# EAGLE design ble121lr_breakout_board_v10 (EAGLE 7.7.0)
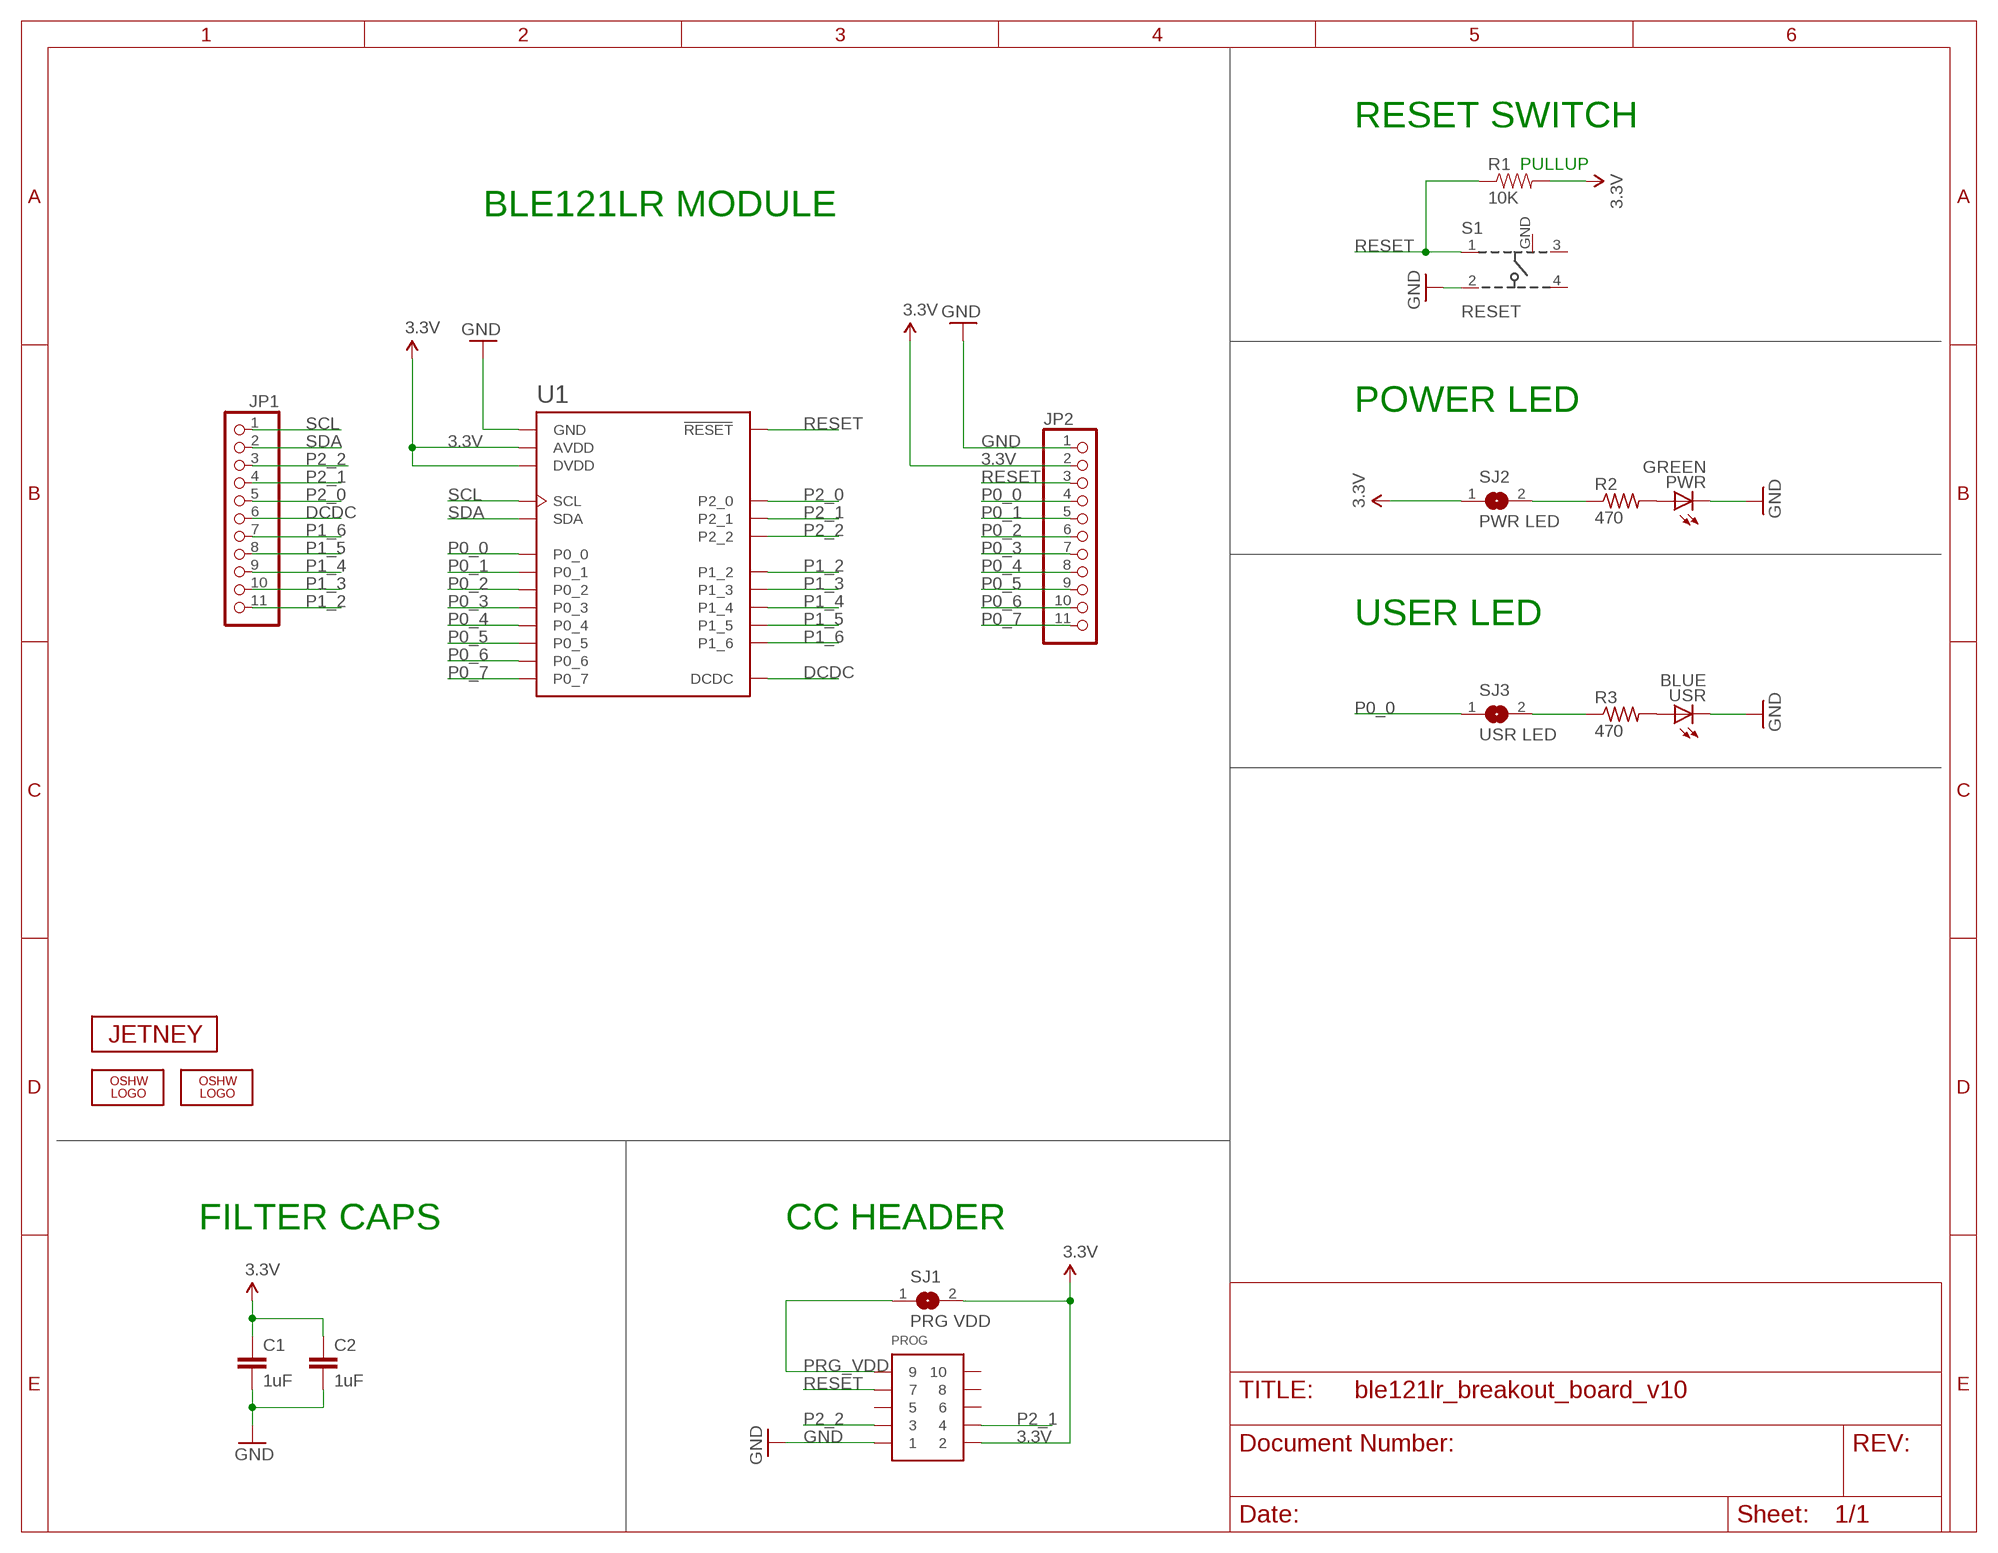
[diagram p0: schematic, sheet 1]

## Parts
C1  1uF  CAP0603-CAP  [0603-CAP]
C2  1uF  CAP0603-CAP  [0603-CAP]
JP1  PINHD-1X11  [1X11]
JP2  PINHD-1X11  [1X11]
LOGO1  OSHW_LOGO_FILLX0100-NT  [OSHW_FILLX100_NOTEXT]
LOGO2  OSHW_LOGO_FILLX0070-NT  [OSHW_FILLX70_NOTEXT]
PROG  CONN_5-2-FTSH-V  [FTSH-105-DV]
PWR  GREEN  LEDCHIPLED_0805  [CHIPLED_0805]
R1  10K  RESISTOR0603-RES  [0603-RES]
R2  470  R-US_R0603  [R0603]
R3  470  R-US_R0603  [R0603]
S1  RESET  101-IG  [101-IG]
SJ1  PRG VDD  SJ  [SJ]
SJ2  PWR LED  SJ  [SJ]
SJ3  USR LED  SJ  [SJ]
U1  BLE121LR-A  [BLE121LR-A]
U$2  JETNEY-LOGO-12  [JETNEY-LOGO-12]
USR  BLUE  LEDCHIPLED_0805  [CHIPLED_0805]

## Nets
3.3V [power]: C1.1 C2.1 JP2.2 PROG.2 R1.2 SJ1.2 SJ2.1 U1.AVDD U1.DVDD
DCDC: JP1.6 U1.DCDC
GND [power]: C1.2 C2.2 JP2.1 PROG.1 PWR.C S1.2 U1.GND U1.GND@2(GND) U1.GND@3(GND) U1.GND@4(GND) U1.GND@5(GND) U1.GND@6(GND) U1.GND@7(GND) U1.GND@8(GND) U1.GND@9(GND) U1.GND@10(GND) U1.GND@11(GND) U1.GND@12(GND) U1.GND@13(GND) USR.C
N$1: PWR.A R2.2
N$3 [power]: R2.1 SJ2.2
N$4: R3.2 USR.A
N$5: R3.1 SJ3.2
P0_0: JP2.4 SJ3.1 U1.P0_0
P0_1: JP2.5 U1.P0_1
P0_2: JP2.6 U1.P0_2
P0_3: JP2.7 U1.P0_3
P0_4: JP2.8 U1.P0_4
P0_5: JP2.9 U1.P0_5
P0_6: JP2.10 U1.P0_6
P0_7: JP2.11 U1.P0_7
P1_2: JP1.11 U1.P1_2
P1_3: JP1.10 U1.P1_3
P1_4: JP1.9 U1.P1_4
P1_5: JP1.8 U1.P1_5
P1_6: JP1.7 U1.P1_6
P2_0: JP1.5 U1.P2_0
P2_1: JP1.4 PROG.4 U1.P2_1
P2_2: JP1.3 PROG.3 U1.P2_2
PRG_VDD [power]: PROG.9 SJ1.1
RESET: JP2.3 PROG.7 R1.1 S1.1 U1.RESET
SCL: JP1.1 U1.SCL
SDA: JP1.2 U1.SDA
Unconnected: PROG.5 PROG.6 PROG.8 PROG.10 S1.3 S1.4

## Notes on the sheet
- RESET SWITCH
- PULLUP
- BLE121LR MODULE
- POWER LED
- USER LED
- FILTER CAPS | CC HEADER

## Power pins joined to a net without a drawn wire
GND: S1.GND

## Library data of the parts
C1 C2 = SparkFun:CAP: Capacitor Standard 0603 ceramic capacitor, and 0.1" leaded capacitor.
JP1 JP2 = sf-pinhead:PINHD-1X11: PIN HEADER
LOGO1 LOGO2 = oshw-logo:OSHW_LOGO_FILL
PROG = pel_misc:CONN_5-2
PWR USR = led:LED: LED OSRAM: - CHIPLED LG R971, LG N971, LY N971, LG Q971, LY Q971, LO R971, LY R971 LH N974, LH R974 LS Q976, LO Q976, LY Q976 LO Q996 - Hyper CHIPLED LW Q18S LB Q993, LB Q99A, LB R99A - SideLED LS A670, LO A670, LY A670, LG A670, LP A670 LB A673, LV A673, LT A673, LW A673 LH A674 LY A675 LS A676, LA A676, LO A676, LY A676, LW A676 LS A679, LY A679, LG A679 - Hyper Micro SIDELED® LS Y876, LA Y876, LO Y876, LY Y876 LT Y87S - SmartLED LW L88C, LW L88S LB L89C, LB L89S, LG L890 LS L89K, LO L89K, LY L89K LS L896, LA L896, LO L896, LY L896 - TOPLED LS T670, LO T670, LY T670, LG T670, LP T670 LSG T670, LSP T670, LSY T670, LOP T670, LYG T670 LG T671, LOG T671, LSG T671 LB T673, LV T673, LT T673, LW T673 LH T674 LS T676, LA T676, LO T676, LY T676, LB T676, LH T676, LSB T676, LW T676 LB T67C, LV T67C, LT T67C, LS T67K, LO T67K, LY T67K, LW E67C LS E67B, LA E67B, LO E67B, LY E67B, LB E67C, LV E67C, LT E67C LW T67C LS T679, LY T679, LG T679 LS T770, LO T770, LY T770, LG T770, LP T770 LB T773, LV T773, LT T773, LW T773 LH T774 LS E675, LA E675, LY E675, LS T675 LS T776, LA T776, LO T776, LY T776, LB T776 LHGB T686 LT T68C, LB T68C - Hyper Mini TOPLED® LB M676 - Mini TOPLED Santana® LG M470 LS M47K, LO M47K, LY M47K Source: http://www.osram.convergy.de LUXEON: - LUMILED® LXK2-PW12-R00, LXK2-PW12-S00, LXK2-PW14-U00, LXK2-PW14-V00 LXK2-PM12-R00, LXK2-PM12-S00, LXK2-PM14-U00 LXK2-PE12-Q00, LXK2-PE12-R00, LXK2-PE12-S00, LXK2-PE14-T00, LXK2-PE14-U00 LXK2-PB12-K00, LXK2-PB12-L00, LXK2-PB12-M00, LXK2-PB14-N00, LXK2-PB14-P00, LXK2-PB14-Q00 LXK2-PR12-L00, LXK2-PR12-M00, LXK2-PR14-Q00, LXK2-PR14-R00 LXK2-PD12-Q00, LXK2-PD12-R00, LXK2-PD12-S00 LXK2-PH12-R00, LXK2-PH12-S00 LXK2-PL12-P00, LXK2-PL12-Q00, LXK2-PL12-R00 Source: www.luxeon.com KINGBRIGHT: KA-3528ASYC Source: www.kingbright.com
R1 = SparkFun:RESISTOR: Resistor Basic schematic elements and footprints for 0603, 1206, and PTH resistors.
R2 R3 = resistor:R-US_: RESISTOR, American symbol
S1 = sf-keyglove:101-IG
SJ1-SJ3 = jumper:SJ: SMD solder JUMPER
U1 = sf-bluegiga:BLE121LR: Bluetooth Low Energy single-mode long-range module - Bluetooth 4.0 (CC2541). BLE121LR-A variant has an on-module ceramic chip antenna. BLE121LR-A variant includes keepout/restrict area. Antenna edge of the module should be flush up against the edge of the PCB. See datasheet for variant layout details. IT IS EXTREMELY IMPORTANT THAT YOU FOLLOW THE LAYOUT GUIDELINES FOR THIS MODULE IN ORDER TO ENSURE MAXIMUM RANGE. THIS MEANS THAT YOU NEED A SOLID GROUND PLANE EXTENDING AT LEAST 17 mm ON THE LEFT AND RIGHT SIDES OF THE MODULE, AS SHOWN IN THE DATASHEET. BLE121LR is a Bluetooth Smart Long Range module targeted for Bluetooth Smart applications where the best possible RF performance and range are required. At +8 dBm TX power and -98 dBm sensitivity BLE121LR has best-in-class RF performance and can provide Bluetooth Smart connectivity up to 450 meters. BLE121LR integrates all features required for a Bluetooth Smart application: Bluetooth radio, software stack and GATT based profiles. and it can also host end user applications, which means no external micro controller is required in size, price or power constrained devices. BLE121LR Bluetooth Smart module also has flexible hardware interfaces to connect to different peripherals or sensors. Although BLE121LR Bluetooth Smart Long Range Module is target for applications requiring high RF performance, it is still has relatively low power consumption and can be power using a standard 3V coin cell batteries. https://www.bluegiga.com/en-US/products/bluetooth-4.0-modules/ble121lr-bluetooth--smart-long https://github.com/jrowberg/sf-oshw Last updated 2014-08-02 by Jeff Rowberg <jeff@rowberg.net>; ANTENNA: On-module ceramic chip antenna
U$2 = sf-keyglove:JETNEY-LOGO

## Net classes
0 default: width 0.152 mm, drill 0.33 mm, clearance 0.152 mm
1 power: width 0.254 mm, drill 0.33 mm, clearance 0.152 mm

## Board
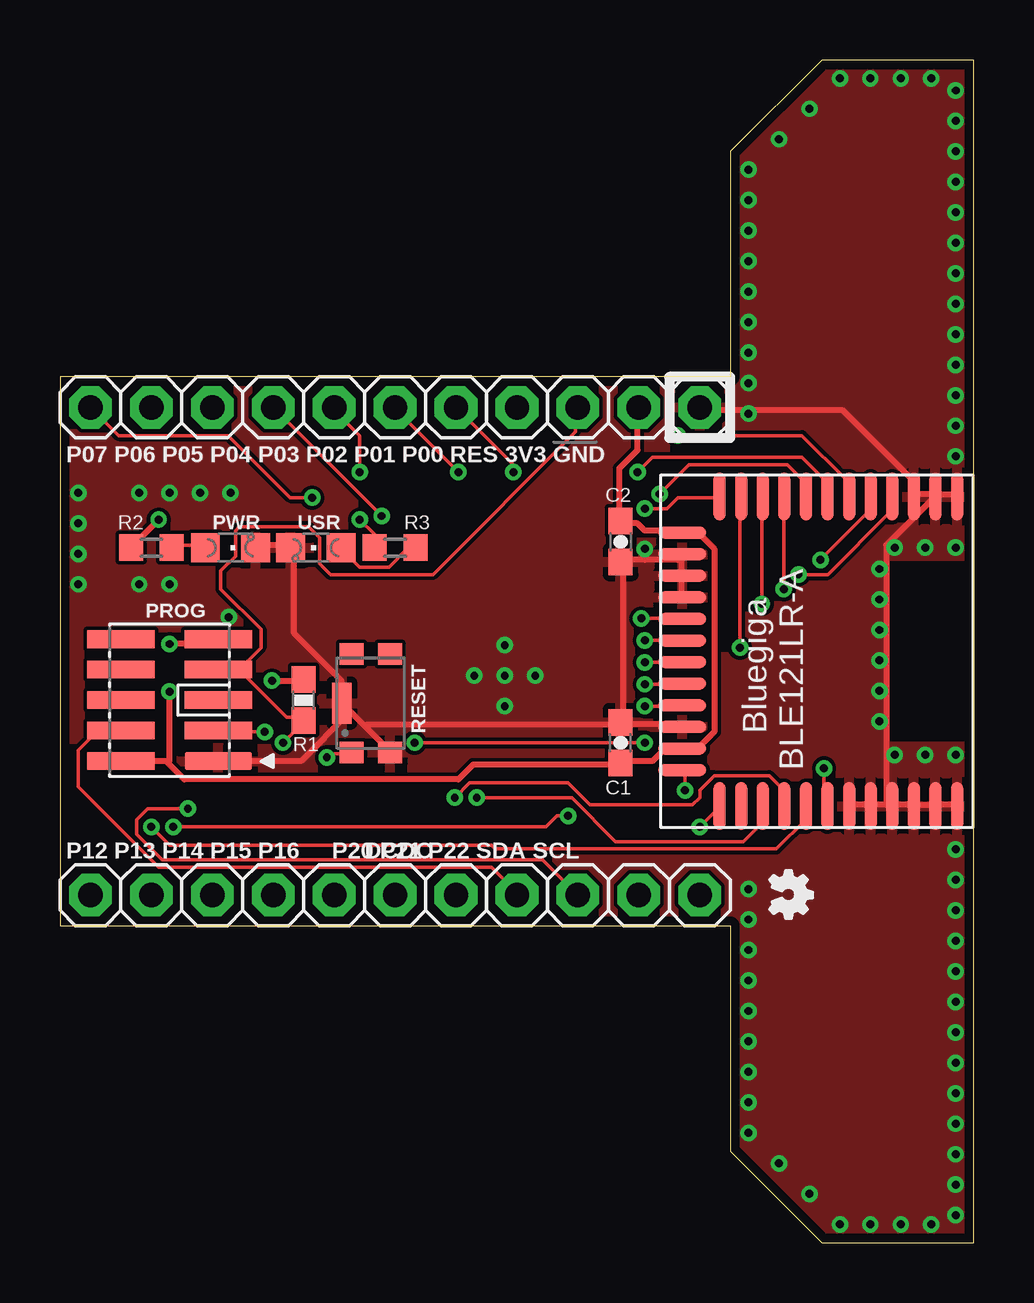
[diagram p1: board, top side]
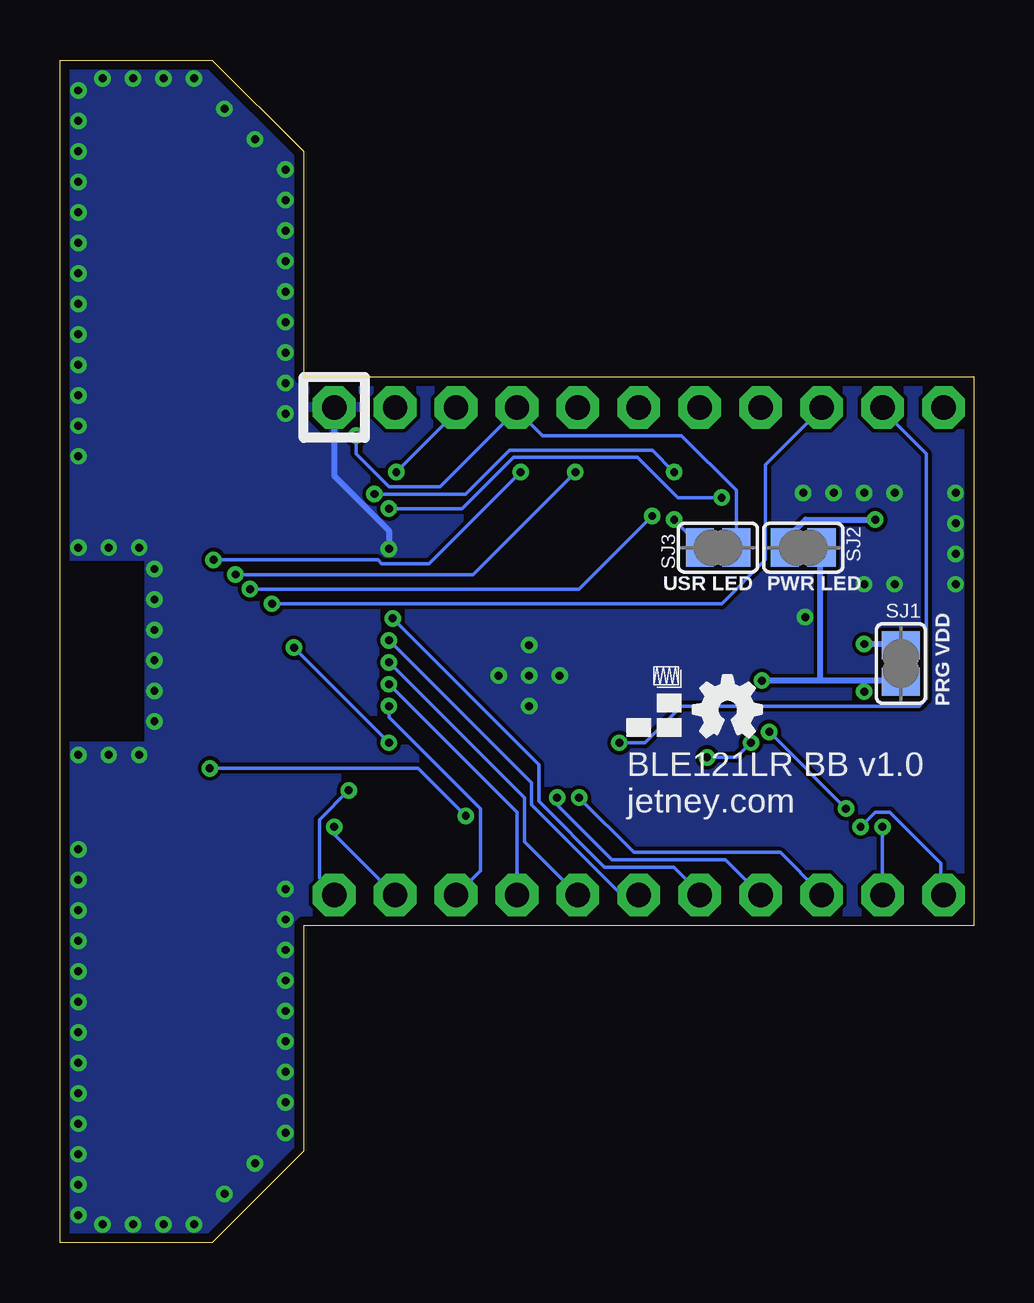
[diagram p2: board, bottom side, seen from below]

Size 38.1 x 49.28 mm. Coordinates in mm from the lower left corner, seen from the top.
Outline: 0,13.21 27.94,13.21 27.94,3.81 31.75,0 38.1,0 38.1,49.28 31.75,49.28 27.94,45.47 27.94,36.07 0,36.07 0,13.21
Copper layers (1*16): Top 0.0356mm / dielectric 1.5011mm / Bottom 0.0356mm
Design rules "default": minimum track width 6mil, minimum drill 13mil, track to track 6mil, track to pad 6mil, pad to pad 6mil, via to via 6mil, smd to smd 6mil, copper to edge 15mil, drill to drill 6mil, minimum pad ring 7mil, minimum via ring 7mil, stop-mask expansion 4mil, vias tented up to drill 13mil, thermal gap 10mil
vRestrict: area 0.3,32.5 to 27.9,33.3; area 0.3,16 to 27.9,16.9

### Footprints (pad centres in the part's own frame; a part is rotated, then mirrored left to right if it is on the bottom)
0603-CAP = smd 1.1 x 1: 1 -0.85,0; 2 0.85,0
1X11 = drill 1.016 pad 1.778 octagon: 1 -12.7,0; 2 -10.16,0; 3 -7.62,0; 4 -5.08,0; 5 -2.54,0; 6 0,0; 7 2.54,0; 8 5.08,0; 9 7.62,0; 10 10.16,0; 11 12.7,0
FTSH-105-DV = smd 0.74 x 2.8: 1 -2.54,-2.03; 2 -2.54,2.03; 3 -1.27,-2.03; 4 -1.27,2.03; 5 0,-2.03; 6 0,2.03; 7 1.27,-2.03; 8 1.27,2.03; 9 2.54,-2.03; 10 2.54,2.03
CHIPLED_0805 = smd 1.2 x 1.2: A 0,-1.05; C 0,1.05
0603-RES = smd 1.1 x 1: 1 -0.85,0; 2 0.85,0
R0603 = smd 1 x 1.1: 1 -0.85,0; 2 0.85,0
101-IG = smd 0.9 x 1: 1 -2.05,0.8; 2 -2.05,-0.8; 3 2.05,0.8; 4 2.05,-0.8 | smd 1.7 x 0.8: GND 0,1.2
SJ = smd 1.168 x 1.6: 1 -0.762,0; 2 0.762,0
BLE121LR-A = smd 0.5 x 2: AVDD -4.95,-5.6; DCDC -0.45,-5.6; DVDD 4.05,-5.6; GND@4 -4.05,-5.6; GND@5 -3.15,-5.6; GND@6 -2.25,-5.6; GND@7 3.15,-5.6; P1_6 -1.35,-5.6; P2_0 0.45,-5.6; P2_1 1.35,-5.6; P2_2 2.25,-5.6; SCL 4.95,-5.6 | smd 2 x 0.5: GND -6.45,5.85; GND@2 -6.45,4.95; GND@3 -6.45,4.05; GND@8 6.45,1.35; GND@9 6.45,2.25; GND@10 6.45,3.15; GND@11 6.45,4.05; GND@12 6.45,4.95; GND@13 6.45,5.85; NC 6.45,-3.15; P0_0 -6.45,1.35; P0_1 -6.45,2.25; P0_2 -6.45,3.15; P0_3 -6.45,-0.45; P0_4 -6.45,-1.35; P0_5 -6.45,-2.25; P0_6 -6.45,-3.15; P0_7 -6.45,-4.05; P1_2 6.45,0.45; P1_3 6.45,-0.45; P1_4 6.45,-1.35; P1_5 6.45,-2.25; RESET -6.45,0.45; SDA 6.45,-4.05

### Placement (x,y rotation side)
C1  23.37,20.83 90 top
C2  23.37,29.21 270 top
JP1  13.97,14.48 180 top
JP2  13.97,34.8 180 top
LOGO1  11.68,21.08 0 bottom
LOGO2  29.59,15.49 270 top
PROG  4.57,22.61 90 top
PWR  7.11,28.96 270 top
R1  10.16,22.61 90 top
R2  3.81,28.96 0 top
R3  13.97,28.96 0 top
S1  12.95,22.48 90 top
SJ1  3.05,24.13 270 bottom
SJ2  7.11,28.96 180 bottom
SJ3  10.67,28.96 180 bottom
U1  31.55,24.64 270 top
U$2  14.48,21.08 0 bottom
USR  10.67,28.96 90 top

### Tracks (layer width: path | path; a pad name or v marks a point on that pad's centre or on a via)
3.3V  (via drill 0.33)
  Top 0.254: v8.84,23.42 10.06,23.42 R1.2 | PROG.2 4.42,20.07 4.5,19.99 | 4.5,19.99 5.18,19.3 16.61,19.3 17.22,19.91 23.32,19.91 C1.1 23.47,20.07 24.69,20.07 25.15,20.52 25.91,20.52 U1.DVDD 26.06,20.68 26.67,20.68 27.28,21.29 27.28,28.91 26.67,29.52 26.06,29.52 U1.AVDD 25.91,29.67 24.38,29.67 24.08,29.97 23.47,29.97 C2.1 23.32,30.12 23.32,32.26 24.08,33.02 24.08,34.7 JP2.2 | v4.57,22.96 4.57,20.07 4.5,19.99
  Bottom 0.254: 4.57,23.42 3.05,23.42 SJ1.2 | 4.57,23.42 6.4,23.42 | 6.4,23.42 v8.84,23.42 | 6.4,23.42 6.4,28.91 SJ2.1 | v4.57,22.96 4.57,23.42
DCDC  (via drill 0.33)
  Top 0.152: v24.38,25.09 25.91,25.09 U1.DCDC
  Bottom 0.152: v24.38,25.09 18.44,19.15 18.44,18.24 14.78,14.58 14.02,14.58 JP1.6
GND  (via drill 0.33)
  Top 0.254: C1.2 23.47,21.59 25.91,21.59 U1.GND@7 | U1.GND@6 25.91,26.92 25.91,27.69 U1.GND@5 25.91,27.84 25.91,28.45 U1.GND@4 | 24.38,28.45 25.76,28.45 25.91,28.6 U1.GND@4 | 24.38,28.45 23.47,28.45 C2.2 23.47,28.3 23.47,21.74 C1.2 | 25.91,28.75 U1.GND@4 | PWR.C 8.23,29.06 9.6,29.06 USR.C 9.75,28.91 9.75,25.4 11.73,23.42 11.73,22.5 S1.GND | 12.72,21.51 11.89,22.35 S1.GND | 12.72,21.51 13.72,20.52 S1.2 | PROG.1 10.06,20.07 12.04,22.05 S1.GND | C1.2 23.32,21.59 12.8,21.59 12.72,21.51 | 37.49,18.24 U1.GND@13 37.34,18.24 36.58,18.24 U1.GND@12 36.42,18.24 35.66,18.24 U1.GND@11 35.51,18.24 34.75,18.24 U1.GND@10 34.59,18.24 34.44,18.24 | U1.GND@8 32.92,18.24 33.68,18.24 U1.GND@9 33.83,18.24 34.44,18.24 | 37.49,31.19 U1.GND 37.34,31.19 36.58,31.19 U1.GND@2 | U1.GND@2 36.42,31.19 35.66,31.19 U1.GND@3 35.51,31.19 35.51,31.8 32.61,34.7 26.67,34.7 JP2.1 | 34.44,18.24 34.44,29.06 36.42,31.04 U1.GND@2 | v24.38,28.91 24.38,28.45
  Bottom 0.254: v24.38,28.91 24.38,29.67 26.67,31.95 JP2.1
  other vias: 37.34,32.77 37.34,16.38 37.34,34.04 37.34,35.31 37.34,36.58 37.34,37.85 37.34,39.12 37.34,40.39 37.34,41.66 37.34,42.93 37.34,44.2 37.34,45.47 37.34,46.74 37.34,48.01 36.32,48.51 35.05,48.51 33.78,48.51 32.51,48.51 31.24,47.24 29.97,45.97 28.7,44.7 28.7,43.43 28.7,42.16 28.7,40.89 28.7,39.62 28.7,38.35 28.7,37.08 28.7,35.81 28.7,34.54 37.34,28.96 36.07,28.96 34.8,28.96 34.16,28.07 34.16,26.8 34.16,25.53 34.16,24.26 34.16,22.99 34.16,21.72 34.8,20.32 36.07,20.32 37.34,20.32 37.34,15.11 37.34,13.84 37.34,12.57 37.34,11.3 37.34,10.03 37.34,8.76 37.34,7.49 37.34,6.22 37.34,4.95 37.34,3.68 37.34,2.41 37.34,1.14 36.32,0.76 35.05,0.76 33.78,0.76 32.51,0.76 31.24,2.03 29.97,3.3 28.7,4.57 28.7,5.84 28.7,7.11 28.7,8.38 28.7,9.65 28.7,10.92 28.7,12.19 28.7,13.46 28.7,14.73 19.81,23.62 18.54,23.62 17.27,23.62 18.54,24.89 18.54,22.35 5.84,31.24 4.57,31.24 3.3,31.24 0.76,31.24 0.76,29.97 0.76,28.7 0.76,27.43 3.3,27.43 7.11,31.24 4.57,27.43 7.04,26.06
  pour Bottom: 0,36.07 27.94,36.07 27.94,50.04 38.1,50.04 38.1,-0.76 27.94,-0.76 27.94,13.21 0,13.21
  pour Top: 0,36.07 27.94,36.07 27.94,50.04 38.1,50.04 38.1,-0.76 27.94,-0.76 27.94,13.21 0,13.21
N$1
  Top 0.152: R2.2 4.72,29.06 5.94,29.06 PWR.A
N$3  (via drill 0.33)
  Top 0.254: v4.12,30.12 3.05,29.06 R2.1
  Bottom 0.254: v4.12,30.12 7.01,30.12 7.77,29.36 7.77,29.06 SJ2.2
N$4
  Top 0.152: R3.2 14.78,28.91 14.48,28.91 13.72,28.14 12.5,28.14 11.73,28.91 USR.A
N$5  (via drill 0.33)
  Top 0.152: v12.5,30.12 13.11,29.52 13.11,29.06 R3.1
  Bottom 0.152: v12.5,30.12 11.43,29.06 SJ3.2
N$6
  Bottom 0.152: 6.6,28.96 7.62,28.96
N$8
  Bottom 0.152: 10.16,28.96 11.18,28.96
N$9
  Bottom 0.152: 3.05,23.62 3.05,24.64
P0_0  (via drill 0.33)
  Top 0.152: v25.76,33.63 30.94,33.63 32.77,31.8 32.77,31.19 U1.P0_0
  Bottom 0.152: SJ3.1 9.91,31.34 12.19,33.63 17.98,33.63 19.05,34.7 | v25.76,33.63 25.76,32.87 24.38,31.5 22.25,31.5 19.05,34.7 | 19.05,34.7 JP2.4
P0_1  (via drill 0.33)
  Top 0.152: v31.7,28.45 33.68,30.43 33.68,31.04 U1.P0_1 | v18.9,32.11 18.9,32.41 JP2.5
  Bottom 0.152: v31.7,28.45 24.84,28.45 24.69,28.3 22.71,28.3 v18.9,32.11
P0_2  (via drill 0.33)
  Top 0.152: v30.79,27.84 32,27.84 34.59,30.43 34.59,31.04 U1.P0_2 | v16.61,32.11 14.02,34.7 JP2.6
  Bottom 0.152: v30.79,27.84 20.88,27.84 v16.61,32.11
P0_3  (via drill 0.33)
  Top 0.152: v24.99,31.19 26.21,32.41 30.33,32.41 31.09,31.65 31.09,31.19 U1.P0_3 | v12.5,32.11 12.5,33.63 11.43,34.7 JP2.7
  Bottom 0.152: v24.99,31.19 21.18,31.19 19.36,33.02 13.41,33.02 v12.5,32.11
P0_4  (via drill 0.33)
  Top 0.152: v30.18,27.23 30.18,31.04 U1.P0_4 | JP2.8 v13.41,30.28
  Bottom 0.152: v30.18,27.23 16.46,27.23 v13.41,30.28
P0_5  (via drill 0.33)
  Top 0.152: v29.26,26.62 29.26,31.04 U1.P0_5
  Bottom 0.152: v29.26,26.62 10.52,26.62 8.69,28.45 8.69,32.41 6.4,34.7 JP2.9
P0_6  (via drill 0.33)
  Top 0.152: v28.35,24.79 28.35,31.04 U1.P0_6 | v14.78,20.83 v24.38,20.83
  Bottom 0.152: v24.38,20.83 v28.35,24.79 | v14.78,20.83 13.72,20.83 12.19,22.35 2.29,22.35 1.98,22.66 1.98,32.87 3.81,34.7 JP2.10
P0_7  (via drill 0.33)
  Top 0.152: v24.38,30.58 25.3,30.58 25.76,31.04 27.43,31.04 U1.P0_7 | v10.52,31.04 9.6,31.04 7.01,33.63 2.44,33.63 JP2.11
  Bottom 0.152: v24.38,30.58 21.34,30.58 19.2,32.72 14.02,32.72 12.34,31.04 v10.52,31.04
P1_2  (via drill 0.33)
  Top 0.152: v31.85,19.76 31.85,18.24 U1.P1_2 | v21.18,17.78 20.73,17.78 20.27,17.32 v4.72,17.32
  Bottom 0.152: v31.85,19.76 23.16,19.76 v21.18,17.78 | v4.72,17.32 4.12,17.93 3.5,17.93 1.37,15.8 1.37,14.58 JP1.11
P1_3  (via drill 0.33)
  Top 0.152: v3.81,17.32 4.57,16.56 17.98,16.56 18.14,16.41 29.87,16.41 31.09,17.63 31.09,18.09 U1.P1_3
  Bottom 0.152: JP1.10 v3.81,17.32
P1_4  (via drill 0.33)
  Top 0.152: v16.46,18.54 17.07,19.15 21.18,19.15 22.1,18.24 26.36,18.24 26.67,18.54 26.67,18.85 27.28,19.46 29.57,19.46 30.18,18.85 30.18,18.24 U1.P1_4
  Bottom 0.152: v16.46,18.54 14.17,16.26 8.08,16.26 6.4,14.58 JP1.9
P1_5  (via drill 0.33)
  Top 0.152: v17.37,18.54 21.34,18.54 23.16,16.71 28.5,16.71 29.26,17.48 29.26,18.09 U1.P1_5
  Bottom 0.152: v17.37,18.54 17.37,18.24 15.09,15.95 10.36,15.95 JP1.8
P1_6  (via drill 0.33)
  Top 0.152: v24.23,26.01 25.91,26.01 U1.P1_6
  Bottom 0.152: v24.23,26.01 18.14,19.91 18.14,18.39 15.39,15.65 12.5,15.65 11.43,14.58 JP1.7
P2_0  (via drill 0.33)
  Top 0.152: v24.38,24.18 25.91,24.18 U1.P2_0
  Bottom 0.152: v24.38,24.18 18.75,18.54 18.75,16.71 JP1.5
P2_1  (via drill 0.33)
  Top 0.152: v24.38,23.27 25.91,23.27 U1.P2_1 | PROG.4 2.44,21.29 1.52,21.29 0.76,20.52 0.76,19 4.12,15.65 17.98,15.65 19.05,14.58 JP1.4
  Bottom 0.152: v24.38,23.27 19.05,17.93 JP1.4
P2_2  (via drill 0.33)
  Top 0.152: v24.38,22.35 25.91,22.35 U1.P2_2 | v8.53,21.29 6.71,21.29 PROG.3 | v5.33,18.09 3.66,18.09 3.2,17.63 3.2,17.02 4.27,15.95 20.12,15.95 JP1.3
  Bottom 0.152: v24.38,22.35 24.38,21.89 20.57,18.09 20.57,15.49 JP1.3 | v5.33,18.09 v8.53,21.29
PRG_VDD  (via drill 0.33)
  Top 0.254: v4.57,24.94 6.4,24.94 6.55,25.09 PROG.9
  Bottom 0.254: v4.57,24.94 3.05,24.94 SJ1.1
RESET  (via drill 0.33)
  Top 0.152: v11.12,20.22 11.28,20.37 12.04,20.37 S1.1 | v9.3,20.83 10.21,21.74 R1.1 10.06,21.89 9.45,21.89 7.47,23.88 | 7.47,23.88 PROG.7 6.71,23.88 | v24.08,32.11 24.69,32.72 30.94,32.72 31.85,31.8 31.85,31.19 U1.RESET | 7.47,23.88 8.38,24.79 8.38,25.55 6.71,27.23 6.71,27.99 7.32,28.6 7.32,29.67 7.47,29.82 10.36,29.82 10.82,29.36 10.82,28.3 11.28,27.84 15.54,27.84 21.49,33.78 21.49,34.7 JP2.3
  Bottom 0.152: v11.12,20.22 9.91,20.22 v9.3,20.83 | v24.08,32.11 21.49,34.7 JP2.3
SCL  (via drill 0.33)
  Top 0.152: v26.06,18.85 26.06,19.61 U1.SCL
  Bottom 0.152: v26.06,18.85 27.28,17.63 27.28,15.19 26.67,14.58 JP1.1
SDA  (via drill 0.33)
  Top 0.152: v26.67,17.32 27.43,18.09 U1.SDA
  Bottom 0.152: v26.67,17.32 26.67,17.02 JP1.2

### Text on the board
tPlace: P07 P06 P05 P04 P03 P02 P01 P00 RES 3V3 GND | RESET | Bluegiga | BLE121LR-A | P12 P13 P14 P15 P16 P20 P21 P22 SDA SCL | DCDC
bPlace: PWR LED | USR LED | PRG VDD | BLE121LR BB v1.0 | jetney.com